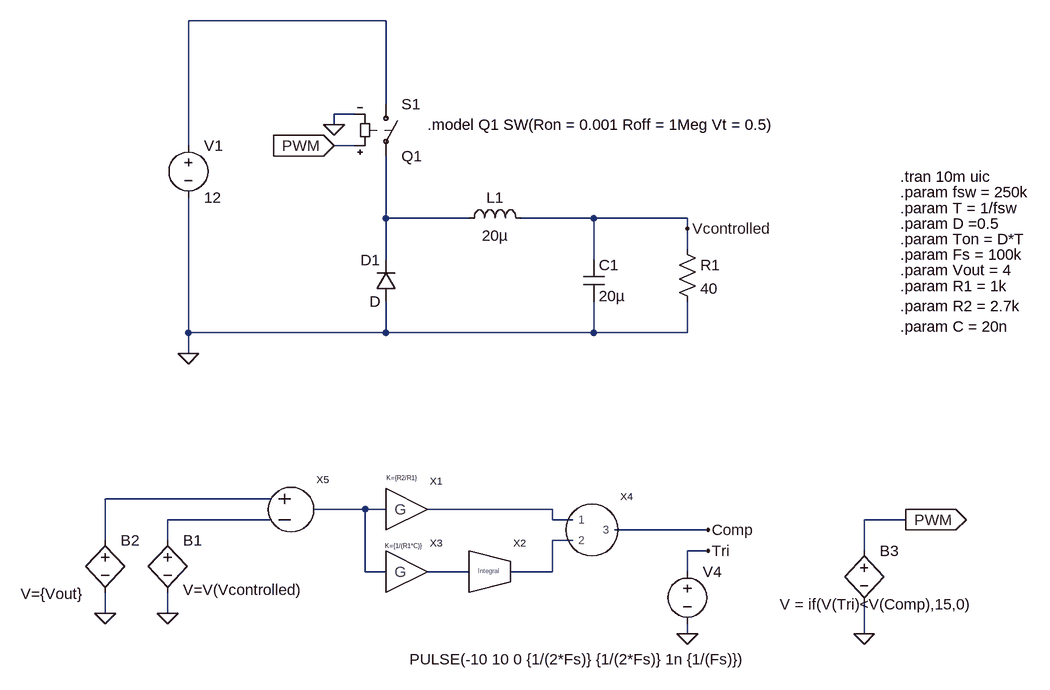
[diagram p0: schematic Close Loop Buck.asc]
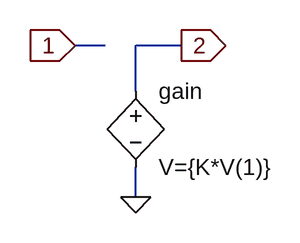
[diagram p1: sub-circuit gain.asc]
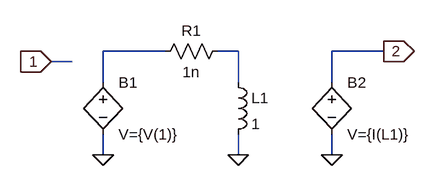
[diagram p2: sub-circuit integral.asc]
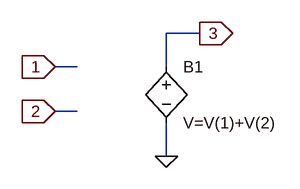
[diagram p3: sub-circuit adder.asc]
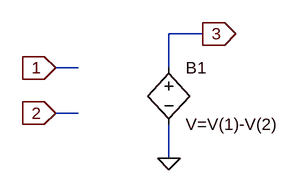
[diagram p4: sub-circuit subtractor.asc]
Close Loop Buck.asc, the LTspice schematic file:
Version 4
SHEET 1 1496 848
WIRE 208 -208 -96 -208
WIRE 208 -80 208 -208
WIRE 160 -64 128 -64
WIRE 128 -48 128 -64
WIRE -96 -16 -96 -208
WIRE 160 -16 128 -16
WIRE 208 96 208 0
WIRE 336 96 208 96
WIRE 528 96 416 96
WIRE 672 96 528 96
WIRE 672 112 672 96
WIRE 672 144 672 112
WIRE 208 160 208 96
WIRE 528 160 528 96
WIRE -96 272 -96 64
WIRE 208 272 208 224
WIRE 208 272 -96 272
WIRE 528 272 528 224
WIRE 528 272 208 272
WIRE 672 272 672 224
WIRE 672 272 528 272
WIRE -96 304 -96 272
WIRE 32 528 -224 528
WIRE 176 544 96 544
WIRE 208 544 176 544
WIRE 464 544 272 544
WIRE 32 560 -128 560
WIRE 464 560 464 544
WIRE 496 560 464 560
WIRE 1008 560 944 560
WIRE 704 576 560 576
WIRE -224 592 -224 528
WIRE -128 592 -128 560
WIRE 496 592 464 592
WIRE 704 608 672 608
WIRE 944 608 944 560
WIRE 176 640 176 544
WIRE 208 640 176 640
WIRE 336 640 272 640
WIRE 464 640 464 592
WIRE 464 640 400 640
WIRE 672 640 672 608
WIRE -224 704 -224 672
WIRE -128 704 -128 672
WIRE 672 736 672 720
WIRE 944 736 944 688
FLAG -96 304 0
FLAG 672 112 Vcontrolled
FLAG -224 704 0
FLAG 672 736 0
FLAG 704 576 Comp
FLAG 704 608 Tri
FLAG 944 736 0
FLAG 128 -48 0
FLAG 1008 560 PWM
IOPIN 1008 560 Out
FLAG 128 -16 PWM
IOPIN 128 -16 In
FLAG -128 704 0
SYMBOL voltage -96 -32 R0
WINDOW 123 0 0 Left 0
WINDOW 39 0 0 Left 0
SYMATTR InstName V1
SYMATTR Value 12
SYMBOL ind 320 112 R270
WINDOW 0 32 56 VTop 2
WINDOW 3 5 56 VBottom 2
SYMATTR InstName L1
SYMATTR Value 20µ
SYMBOL res 656 128 R0
SYMATTR InstName R1
SYMATTR Value 40
SYMBOL diode 224 224 R180
WINDOW 0 24 64 Left 2
WINDOW 3 24 0 Left 2
SYMATTR InstName D1
SYMBOL sw 208 -96 R0
SYMATTR InstName S1
SYMATTR Value Q1
SYMBOL cap 512 160 R0
SYMATTR InstName C1
SYMATTR Value 20µ
SYMBOL Gain 240 544 R0
WINDOW 39 -31 -48 Left 0
SYMATTR InstName X1
SYMATTR SpiceLine K={R2/R1}
SYMBOL Integral 368 640 R0
SYMATTR InstName X2
SYMBOL Gain 240 640 R0
WINDOW 39 -33 -40 Left 0
SYMATTR InstName X3
SYMATTR SpiceLine K={1/(R1*C)}
SYMBOL adder 528 576 R0
SYMATTR InstName X4
SYMBOL bv -128 576 R0
WINDOW 3 24 92 Left 2
SYMATTR InstName B1
SYMATTR Value V=V(Vcontrolled)
SYMBOL subtractor 64 544 R0
SYMATTR InstName X5
SYMBOL voltage 672 624 R0
WINDOW 3 -428 151 Left 2
WINDOW 123 0 0 Left 0
WINDOW 39 0 0 Left 0
SYMATTR InstName V4
SYMATTR Value PULSE(-10 10 0 {1/(2*Fs)} {1/(2*Fs)} 1n {1/(Fs)})
SYMBOL bv -224 576 R0
WINDOW 3 -130 98 Left 2
SYMATTR InstName B2
SYMATTR Value V={Vout}
SYMBOL bv 944 592 R0
WINDOW 3 -130 98 Left 2
SYMATTR InstName B3
SYMATTR Value V = if(V(Tri)<V(Comp),15,0)
TEXT 1000 32 Left 2 !.tran 10m uic
TEXT 1000 56 Left 2 !.param fsw = 250k
TEXT 1000 80 Left 2 !.param T = 1/fsw
TEXT 1000 104 Left 2 !.param D =0.5
TEXT 1000 128 Left 2 !.param Ton = D*T
TEXT 272 -48 Left 2 !.model Q1 SW(Ron = 0.001 Roff = 1Meg Vt = 0.5)
TEXT 1000 200 Left 2 !.param R1 = 1k\n.param R2 = 2.7k\n.param C = 20n
TEXT 1000 152 Left 2 !.param Fs = 100k
TEXT 1000 176 Left 2 !.param Vout = 4

gain.asc, the sub-circuit schematic file:
Version 4
SHEET 1 880 680
WIRE 128 144 96 144
WIRE 208 144 160 144
WIRE 160 192 160 144
WIRE 160 304 160 272
FLAG 96 144 1
IOPIN 96 144 In
FLAG 208 144 2
IOPIN 208 144 Out
FLAG 160 304 0
SYMBOL bv 160 176 R0
SYMATTR InstName gain
SYMATTR Value V={K*V(1)}

integral.asc, the sub-circuit schematic file:
Version 4
SHEET 1 880 680
WIRE 192 112 96 112
WIRE 304 112 272 112
WIRE 528 112 448 112
WIRE 48 128 16 128
WIRE 96 160 96 112
WIRE 304 160 304 112
WIRE 448 160 448 112
WIRE 96 272 96 240
WIRE 304 272 304 240
WIRE 448 272 448 240
FLAG 16 128 1
IOPIN 16 128 In
FLAG 528 112 2
IOPIN 528 112 Out
FLAG 96 272 0
FLAG 304 272 0
FLAG 448 272 0
SYMBOL bv 96 144 R0
SYMATTR InstName B1
SYMATTR Value V={V(1)}
SYMBOL bv 448 144 R0
SYMATTR InstName B2
SYMATTR Value V={I(L1)}
SYMBOL res 288 96 R90
WINDOW 0 0 56 VBottom 2
WINDOW 3 32 56 VTop 2
SYMATTR InstName R1
SYMATTR Value 1n
SYMBOL ind 288 144 R0
SYMATTR InstName L1
SYMATTR Value 1

adder.asc, the sub-circuit schematic file:
Version 4
SHEET 1 880 680
WIRE 176 64 128 64
WIRE 0 112 -32 112
WIRE 128 112 128 64
WIRE 0 176 -32 176
WIRE 128 240 128 192
FLAG -32 112 1
IOPIN -32 112 In
FLAG -32 176 2
IOPIN -32 176 In
FLAG 128 240 0
FLAG 176 64 3
IOPIN 176 64 Out
SYMBOL bv 128 96 R0
SYMATTR InstName B1
SYMATTR Value V=V(1)+V(2)

subtractor.asc, the sub-circuit schematic file:
Version 4
SHEET 1 880 680
WIRE 304 96 256 96
WIRE 128 144 96 144
WIRE 256 144 256 96
WIRE 128 208 96 208
WIRE 256 272 256 224
FLAG 96 144 1
IOPIN 96 144 In
FLAG 96 208 2
IOPIN 96 208 In
FLAG 256 272 0
FLAG 304 96 3
IOPIN 304 96 Out
SYMBOL bv 256 128 R0
SYMATTR InstName B1
SYMATTR Value V=V(1)-V(2)

The netlist it stands for:
* Close Loop Buck.asc
V1 N001 0 12
L1 N002 Vcontrolled 20µ
R1 Vcontrolled 0 40
D1 0 N002 D
S1 N001 N002 PWM 0 Q1
C1 Vcontrolled 0 20µ
XX1 N004 N005 gain params: K={R2/R1}
XX2 N008 N007 integral
XX3 N004 N008 gain params: K={1/(R1*C)}
XX4 N005 N007 Comp adder
B1 N006 0 V=V(Vcontrolled)
XX5 N003 N006 N004 subtractor
V4 Tri 0 PULSE(-10 10 0 {1/(2*Fs)} {1/(2*Fs)} 1n {1/(Fs)})
B2 N003 0 V={Vout}
B3 PWM 0 V = if(V(Tri)<V(Comp),15,0)

* block symbol definitions
.subckt gain 1 2
B§gain 2 0 V={K*V(1)}
.ends gain

.subckt integral 1 2
B1 N001 0 V={V(1)}
B2 2 0 V={I(L1)}
R1 N002 N001 1n
L1 N002 0 1
.ends integral

.subckt adder 1 2 3
B1 3 0 V=V(1)+V(2)
.ends adder

.subckt subtractor 1 2 3
B1 3 0 V=V(1)-V(2)
.ends subtractor

.model D D
.lib standard.dio
.tran 10m uic
.param fsw = 250k
.param T = 1/fsw
.param D =0.5
.param Ton = D*T
.model Q1 SW(Ron = 0.001 Roff = 1Meg Vt = 0.5)
.param R1 = 1k
.param R2 = 2.7k
.param C = 20n
.param Fs = 100k
.param Vout = 4
.backanno
.end